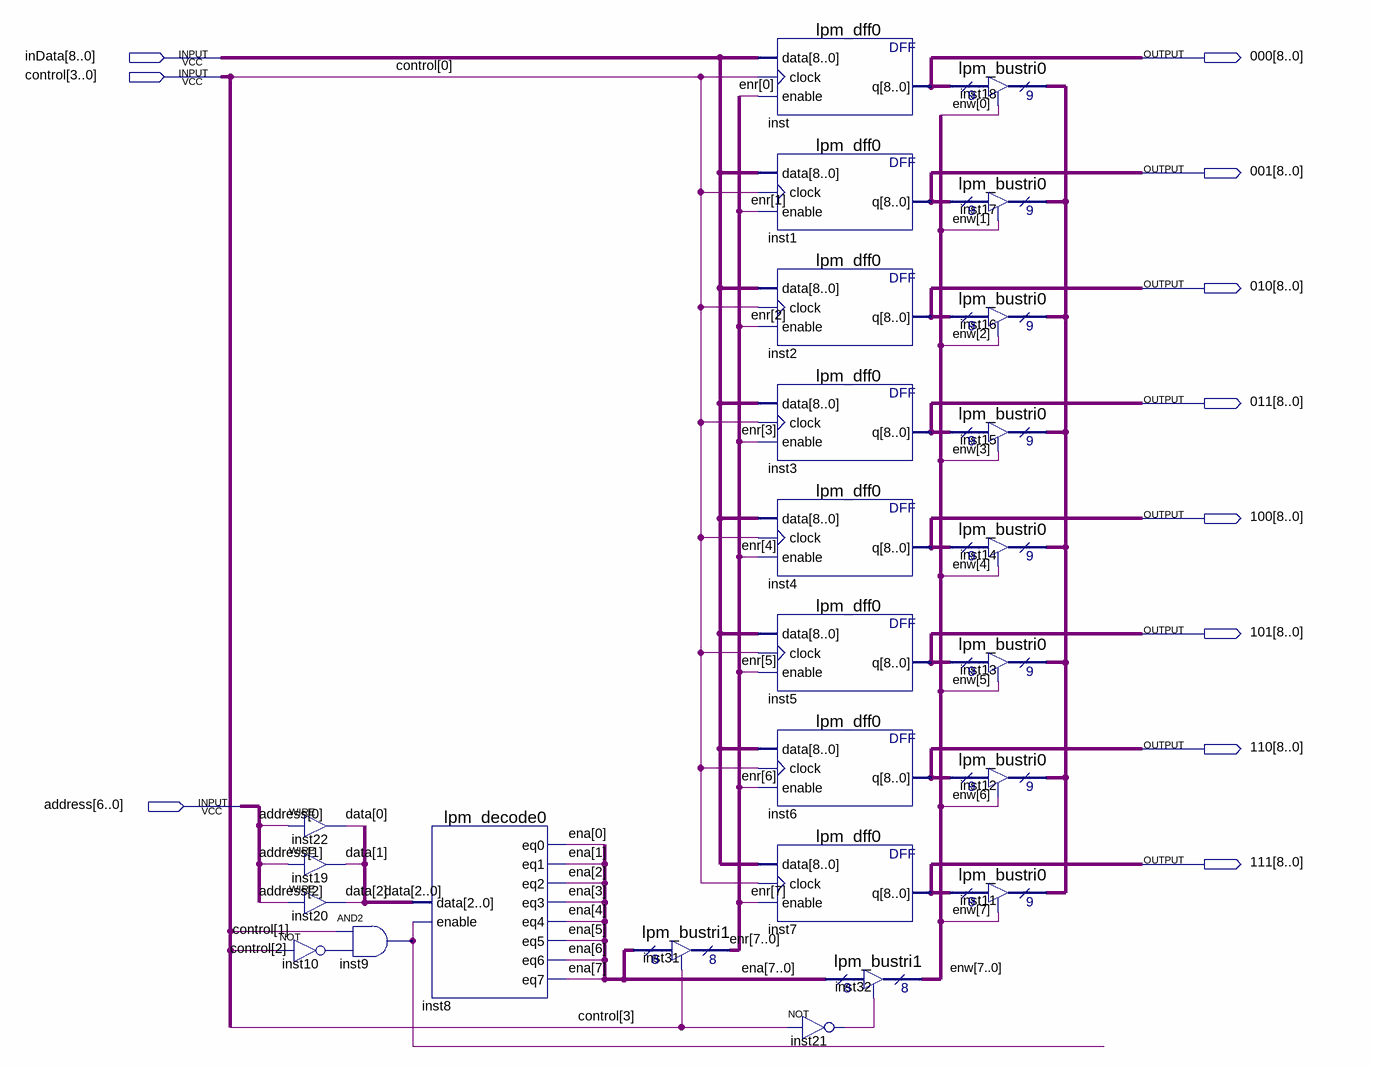
[diagram p0: schematic sheet]
// Quartus schematic REG.bdf as structural Verilog: 25 symbols, 11 pins
module REG (
  input  [8:0] inData,
  input  [3:0] control,
  input  [6:0] address,
  output [8:0] \000 ,
  output [8:0] \001 ,
  output [8:0] \010 ,
  output [8:0] \011 ,
  output [8:0] \100 ,
  output [8:0] \101 ,
  output [8:0] \110 ,
  output [8:0] \111 
);

  wire inst9_out, inst10_out, inst21_out;
  wire [2:0] data;
  wire [7:0] ena, enr, enw;
  wire [8:0] inst18_tridata;

  not inst10 (inst10_out, control[2]);
  assign data[0] = address[0];  // WIRE inst22
  assign data[1] = address[1];  // WIRE inst19
  assign data[2] = address[2];  // WIRE inst20
  and inst9 (inst9_out, control[1], inst10_out);
  lpm_decode0 inst8 (
    .data(data), .enable(inst9_out), .eq0(ena[0]), .eq1(ena[1]), .eq2(ena[2]), .eq3(ena[3]), .eq4(ena[4]),
    .eq5(ena[5]), .eq6(ena[6]), .eq7(ena[7]));
  lpm_bustri1 inst31 (.enabledt(control[3]), .data(ena), .tridata(enr));
  lpm_dff0 inst (.data(inData), .clock(control[0]), .enable(enr[0]), .q(\000 ));
  lpm_dff0 inst1 (.data(inData), .clock(control[0]), .enable(enr[1]), .q(\001 ));
  lpm_dff0 inst2 (.data(inData), .clock(control[0]), .enable(enr[2]), .q(\010 ));
  lpm_dff0 inst3 (.data(inData), .clock(control[0]), .enable(enr[3]), .q(\011 ));
  lpm_dff0 inst4 (.data(inData), .clock(control[0]), .enable(enr[4]), .q(\100 ));
  lpm_dff0 inst5 (.data(inData), .clock(control[0]), .enable(enr[5]), .q(\101 ));
  lpm_dff0 inst6 (.data(inData), .clock(control[0]), .enable(enr[6]), .q(\110 ));
  lpm_dff0 inst7 (.data(inData), .clock(control[0]), .enable(enr[7]), .q(\111 ));
  not inst21 (inst21_out, control[3]);
  lpm_bustri1 inst32 (.enabledt(inst21_out), .data(ena), .tridata(enw));
  lpm_bustri0 inst18 (.enabledt(enw[0]), .data(\000 ), .tridata(inst18_tridata));
  lpm_bustri0 inst17 (.enabledt(enw[1]), .data(\001 ), .tridata(inst18_tridata));
  lpm_bustri0 inst16 (.enabledt(enw[2]), .data(\010 ), .tridata(inst18_tridata));
  lpm_bustri0 inst15 (.enabledt(enw[3]), .data(\011 ), .tridata(inst18_tridata));
  lpm_bustri0 inst14 (.enabledt(enw[4]), .data(\100 ), .tridata(inst18_tridata));
  lpm_bustri0 inst13 (.enabledt(enw[5]), .data(\101 ), .tridata(inst18_tridata));
  lpm_bustri0 inst12 (.enabledt(enw[6]), .data(\110 ), .tridata(inst18_tridata));
  lpm_bustri0 inst11 (.enabledt(enw[7]), .data(\111 ), .tridata(inst18_tridata));
endmodule
